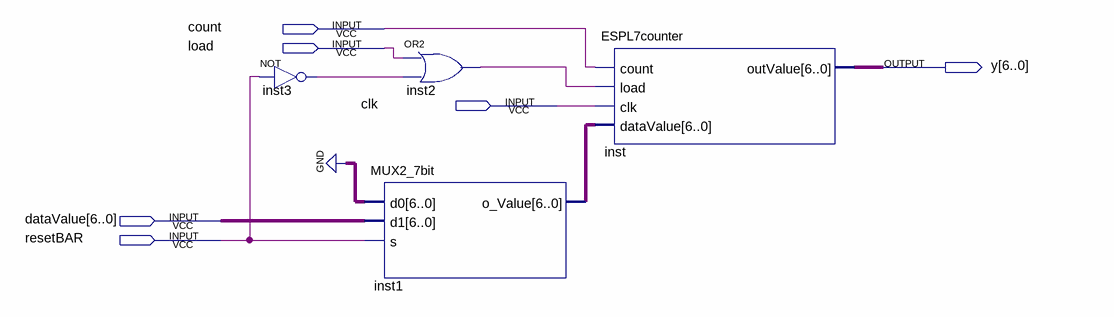
[diagram p0: schematic sheet]
// Quartus schematic loadableCounter.bdf as structural Verilog: 4 symbols, 6 pins
module loadableCounter (
  input  count,
  input  load,
  input  clk,
  input  [6:0] dataValue,
  input  resetBAR,
  output [6:0] y
);

  wire inst2_out, inst3_out;
  wire [6:0] inst1_o_value;

  not inst3 (inst3_out, resetBAR);
  or inst2 (inst2_out, load, inst3_out);
  MUX2_7bit inst1 (.d0({7{1'b0}}), .d1(dataValue), .s(resetBAR), .o_Value(inst1_o_value));
  ESPL7counter inst (.count(count), .load(inst2_out), .clk(clk), .dataValue(inst1_o_value), .outValue(y));
endmodule
